# EAGLE design NCP1400_5V_Step-Up_v11 (EAGLE 5.01)
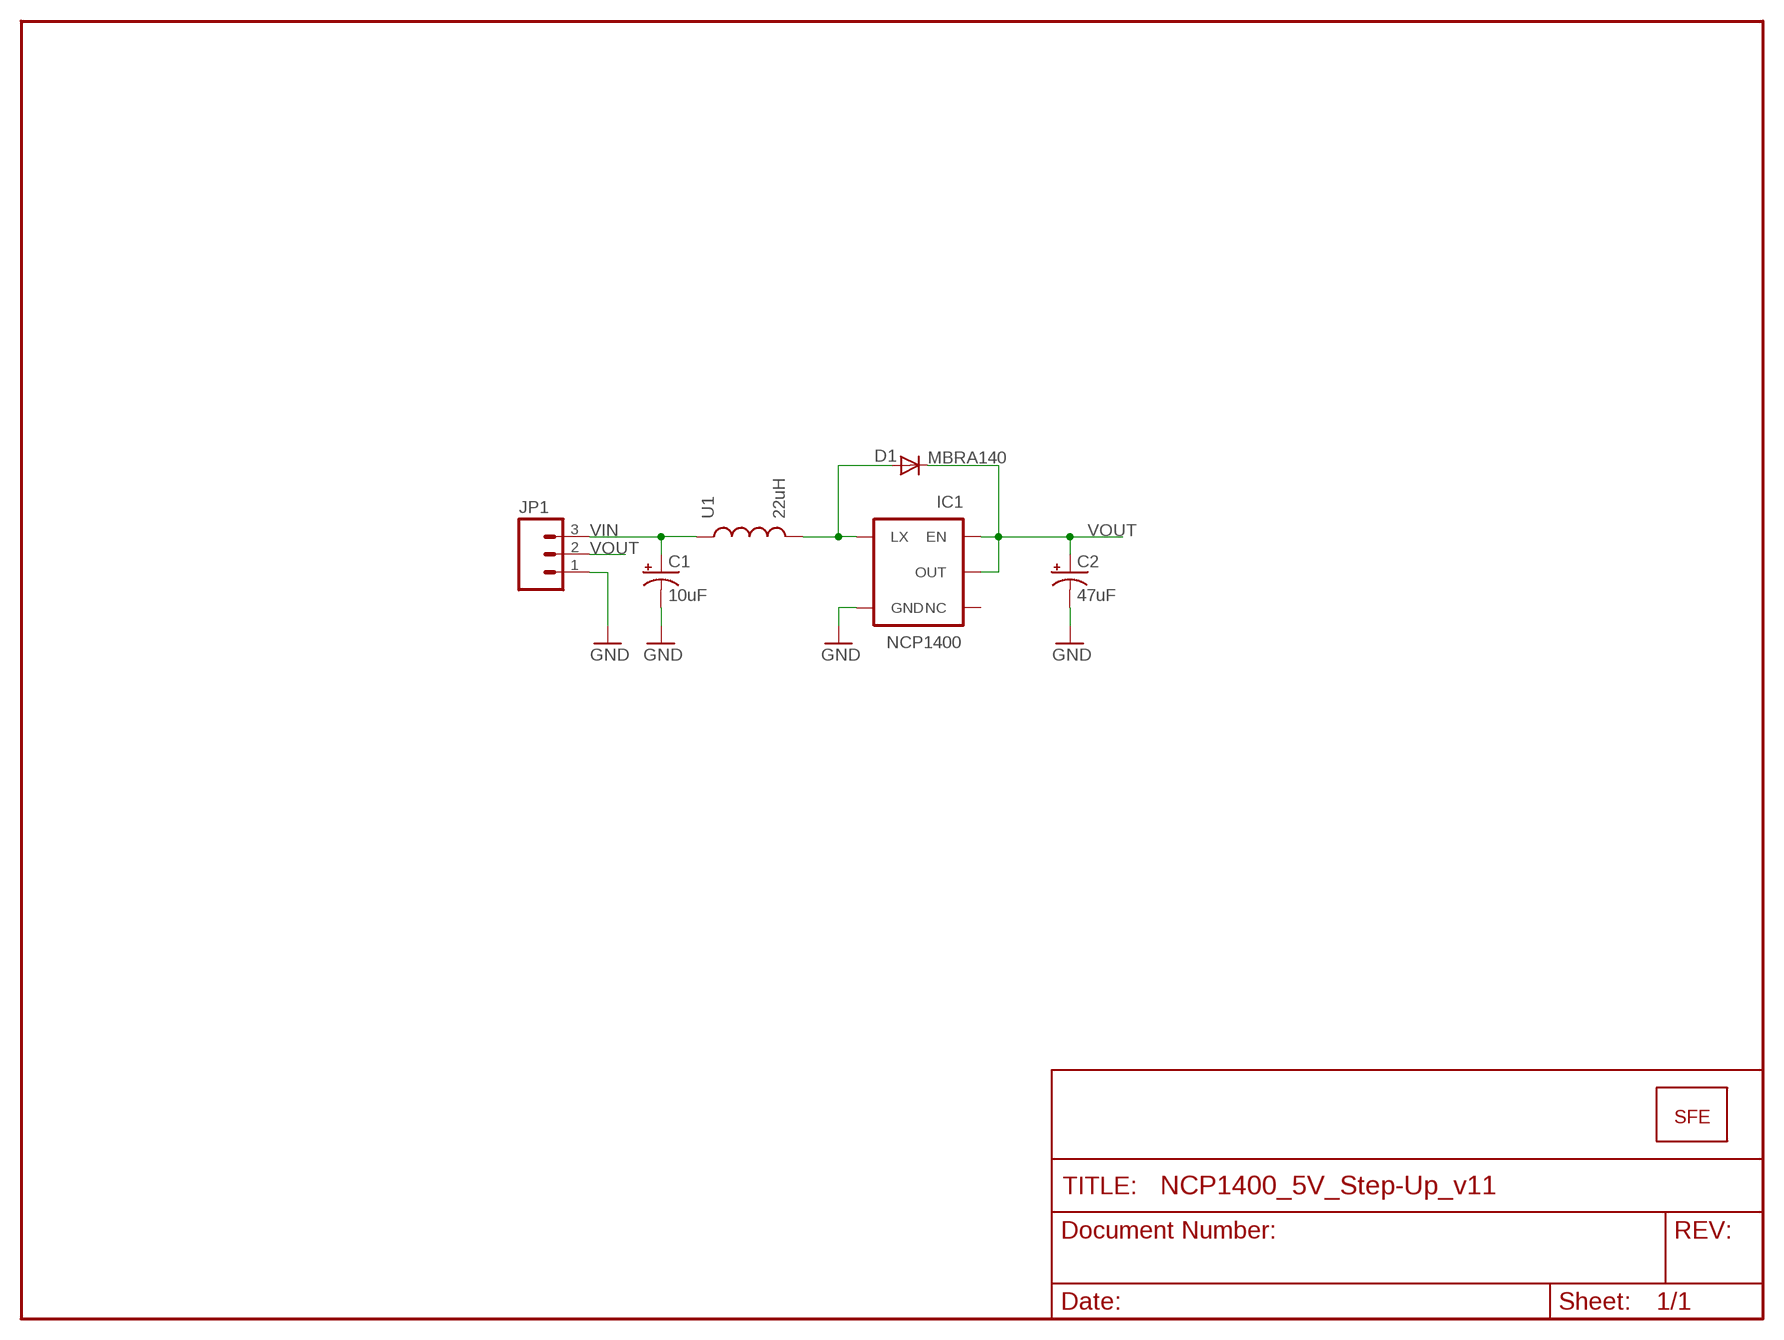
[diagram p0: schematic, sheet 1]

## Parts
C1  10uF  CAP_POL1206  [EIA3216]
C2  47uF  CAP_POL3528  [EIA3528]
D1  MBRA140  DIODESMA  [SMA-DIODE]
IC1  NCP1400  V_REG_NCP1400SOT23-5  [SOT23-5]
JP1  M03PTH  [1X03]
U1  22uH  INDUCTORCR54  [CR54]
U$1  LOGO-SFESK  [SFE-LOGO-FLAME]

## Nets
GND: C1.C(-) C2.C(-) IC1.4(GND) JP1.1
N$3: D1.A IC1.5(LX) U1.P$2
VIN: C1.A(+) JP1.3 U1.P$1
VOUT: C2.A(+) D1.C IC1.1(EN) IC1.2(OUT) JP1.2
Unconnected: IC1.3(NC)

## Library data of the parts
C1 C2 = SparkFun:CAP_POL: Capacitor Polarized These are standard SMD and PTH capacitors. Normally 10uF, 47uF, and 100uF in electrolytic and tantalum varieties. Always verify the external diameter of the through hole cap, it varies with capacity, voltage, and manufacturer. The EIA devices should be standard.
D1 = SparkFun:DIODE: Diode These are standard reverse protection diodes and small signal diodes. SMA package can handle up to about 1A. SOD-323 can handle about 200mA. What the SOD-323 package when ordering, there are some mfgs out there that are 5-pin packages.
IC1 = SparkFun:V_REG_NCP1400: Switching step-up voltage regulator NCP1400 switiching regulator takes single cell AA and outputs 100mA at 3.3V or 5V with minimal number of external components.
JP1 = SparkFun:M03: Header 3 Standard 3-pin 0.1" header. Use with straight break away headers (SKU : PRT-00116), right angle break away headers (PRT-00553), swiss pins (PRT-00743), machine pins (PRT-00117), and female headers (PRT-00115). Molex polarized connector foot print use with SKU : PRT-08232 with associated crimp pins and housings.
U1 = SparkFun:INDUCTOR: Inductors Basic Inductor/Choke - 0603 and 1206. Footprints are not proven and vary greatly between part numbers.
U$1 = SparkFun:LOGO-SFE: Spark Fun Electronics PCB Logo This is the standard Spark Fun Electronics PCB logo.

## Board
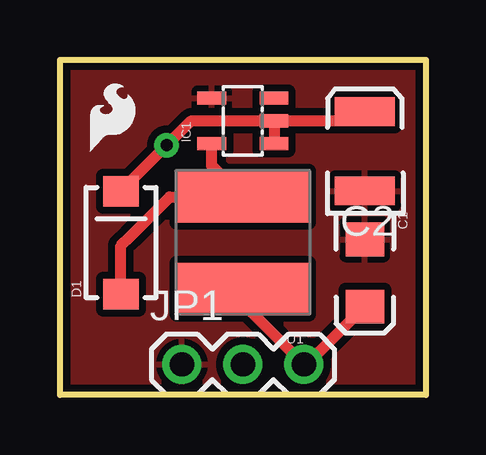
[diagram p1: board, top side]
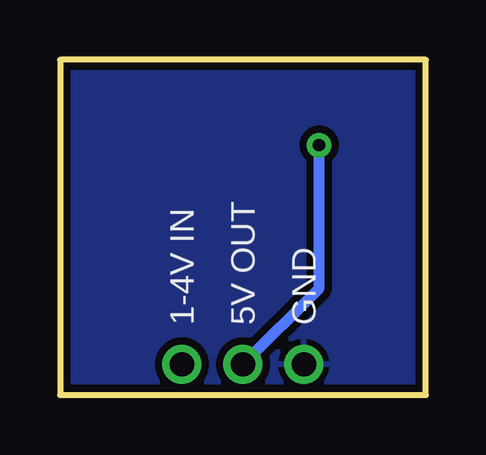
[diagram p2: board, bottom side, seen from below]

Size 15.24 x 13.97 mm. Coordinates in mm from the lower left corner, seen from the top.
Outline: 0,0 0,13.97 15.24,13.97 15.24,0 0,0
Copper layers (1*16): Top 0.0356mm / dielectric 1.5011mm / Bottom 0.0356mm
Design rules "default *": minimum track width 8mil, minimum drill 20mil, track to track 8mil, track to pad 8mil, pad to pad 8mil, via to via 8mil, smd to smd 8mil, copper to edge 10mil, drill to drill 8mil, minimum pad ring 12mil, minimum via ring 10mil, stop-mask expansion 4mil, vias tented up to drill 20mil, thermal gap 10mil

### Footprints (pad centres in the part's own frame; a part is rotated, then mirrored left to right if it is on the bottom)
EIA3216 = smd 1.4 x 1.6: A 1.4,0; C -1.4,0
EIA3528 = smd 1.2 x 2.5: A 1.65,0; C -1.65,0
SMA-DIODE = smd 1.27 x 1.47: A -2.15,0; C 2.15,0
SOT23-5 = smd 0.55 x 1.2: 1 -0.95,-1.3; 2 0,-1.3; 3 0.95,-1.3; 4 0.95,1.3; 5 -0.95,1.3
1X03 = drill 1.016 round: 1 0,0; 2 2.54,0; 3 5.08,0
CR54 = smd 5.5 x 2.15: P$1 0,1.92; P$2 0,-1.92

### Placement (x,y rotation side)
C1  12.7,5.08 270 top
C2  12.7,10.16 90 top
D1  2.54,6.35 90 top
IC1  7.62,11.43 90 top
JP1  5.08,1.27 0 top
U1  7.62,6.35 180 top
U$1  1.27,10.16 0 top

### Tracks (layer width: path | path; a pad name or v marks a point on that pad's centre or on a via)
GND
  pour Bottom (isolate 0.305): 0,0 0,13.97 15.24,13.97 15.24,0
  pour Top (isolate 0.305): 0,0 0,13.97 15.24,13.97 15.24,0
N$3
  Top 0.457: 7.62,8.26 U1.P$2 7.62,8.26 | IC1.5 6.32,9.55 7.62,8.26 | D1.A 2.54,6.22 2.92,6.6 4.57,8.26 7.62,8.26
VIN
  Top 0.457: U1.P$1 7.62,4.57 7.62,3.81 JP1.3 10.29,1.27 C1.A
VOUT  (via drill 0.51)
  Top 0.457: IC1.1 8.92,10.51 8.89,10.54 8.92,10.57 IC1.2 | IC1.2 8.76,11.43 5.47,11.43 v4.45,10.41 4.45,10.29 4.33,10.29 D1.C | C2.A 12.7,11.43 IC1.2
  Bottom 0.457: v4.45,10.41 4.45,4.45 JP1.2

### Text on the board
bPlace: GND | 5V OUT | 1-4V IN